# Altium schematic sheet Tree.SchDoc
size B; SheetNumber: 1; SheetTotal: 6
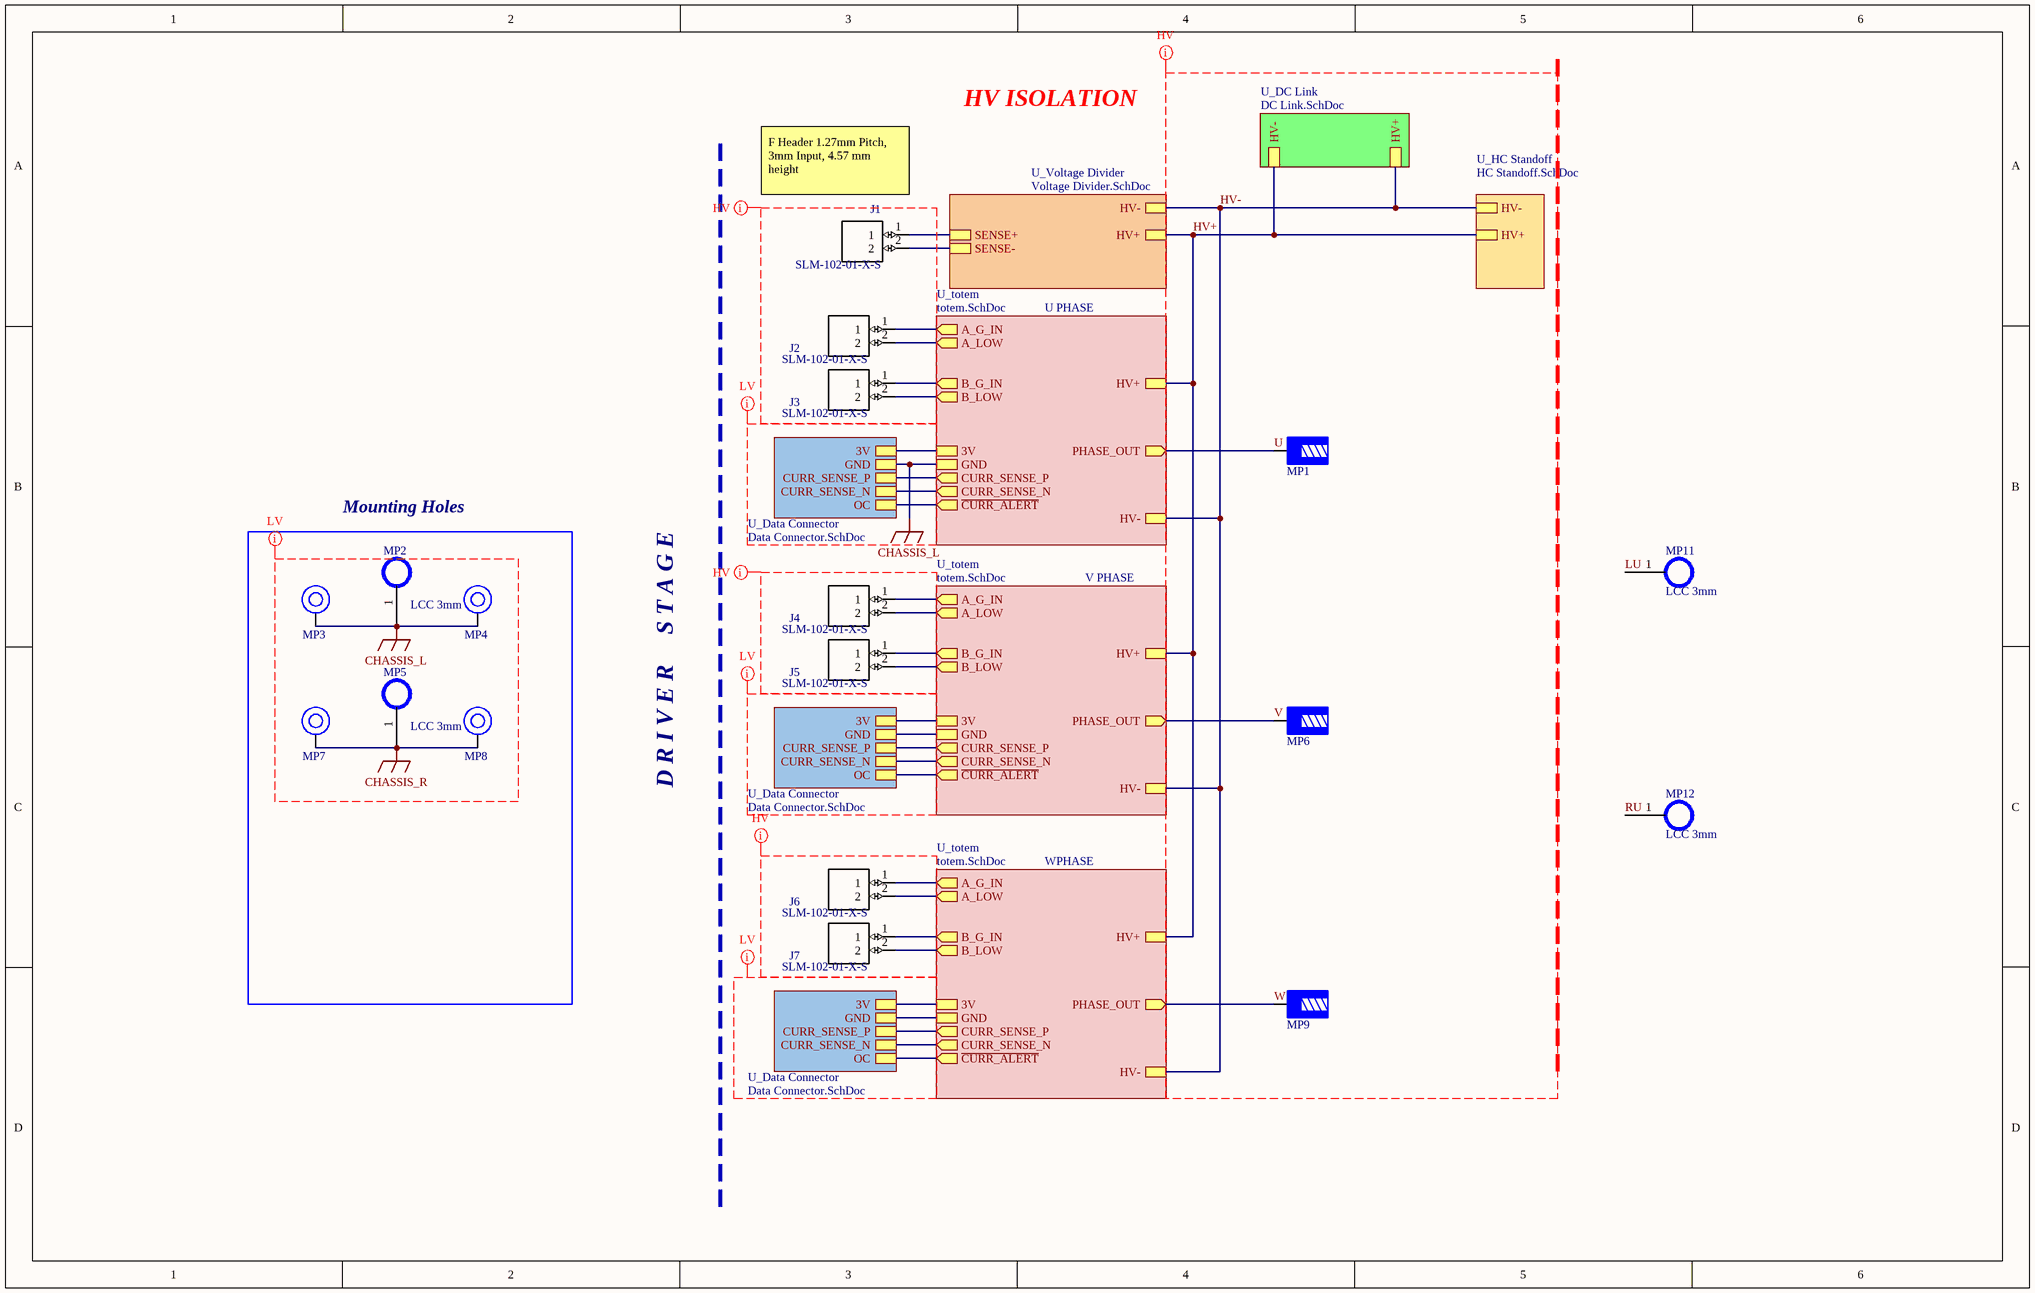
[diagram p0: Tree.SchDoc]

## Parts
J1  SLM-102-01-X-S  [*SLM-102-01-X-S]
J2  SLM-102-01-X-S  [*SLM-102-01-X-S]
J3  SLM-102-01-X-S  [*SLM-102-01-X-S]
J4  SLM-102-01-X-S  [*SLM-102-01-X-S]
J5  SLM-102-01-X-S  [*SLM-102-01-X-S]
J6  SLM-102-01-X-S  [*SLM-102-01-X-S]
J7  SLM-102-01-X-S  [*SLM-102-01-X-S]
MP1  M5 x 6mm  [7460305_HAL]  (value not drawn)
MP2  LCC 3mm  [PAD 3MM]
MP3  hole 3.3mm x 6mm  [9774060960]  (value not drawn)
MP4  hole 3.3mm x 6mm  [9774060960]  (value not drawn)
MP5  LCC 3mm  [PAD 3MM]
MP6  M5 x 6mm  [7460305_HAL]  (value not drawn)
MP7  hole 3.3mm x 6mm  [9774060960]  (value not drawn)
MP8  hole 3.3mm x 6mm  [9774060960]  (value not drawn)
MP9  M5 x 6mm  [7460305_HAL]  (value not drawn)
MP11  LCC 3mm  [PAD 3MM]
MP12  LCC 3mm  [PAD 3MM]

## Blocks framed on the sheet
Mounting Holes: MP2-MP5 MP7 MP8

## Sub-sheets
U_Data Connector = Data Connector.SchDoc: GND, OC, 3V, CURR_SENSE_P, CURR_SENSE_N
U_Data Connector = Data Connector.SchDoc: GND, OC, 3V, CURR_SENSE_P, CURR_SENSE_N
U_Data Connector = Data Connector.SchDoc: GND, OC, 3V, CURR_SENSE_P, CURR_SENSE_N
U_DC Link = DC Link.SchDoc: HV+, HV-
U_HC Standoff = HC Standoff.SchDoc: HV+, HV-
U_totem = totem.SchDoc: PHASE_OUT (out), B_LOW (out), B_G_IN (out), A_LOW (out), A_G_IN (out), ~{CURR_ALERT} (out), HV+, HV-, 3V, GND, CURR_SENSE_P (out), CURR_SENSE_N (out)
U_totem = totem.SchDoc: PHASE_OUT (out), B_LOW (out), B_G_IN (out), A_LOW (out), A_G_IN (out), ~{CURR_ALERT} (out), HV+, HV-, 3V, GND, CURR_SENSE_P (out), CURR_SENSE_N (out)
U_totem = totem.SchDoc: PHASE_OUT (out), B_LOW (out), B_G_IN (out), A_LOW (out), A_G_IN (out), ~{CURR_ALERT} (out), HV+, HV-, 3V, GND, CURR_SENSE_P (out), CURR_SENSE_N (out)
U_Voltage Divider = Voltage Divider.SchDoc: HV+, HV-, SENSE+, SENSE-  | ClassName: U PHASE

## Nets
CHASSIS_L: MP2.1 MP3.1 MP4.1 ; sheet U_Data Connector/GND, sheet U_totem/GND
CHASSIS_R: MP5.1 MP7.1 MP8.1
HV+: sheet U_HC Standoff/HV+, sheet U_Voltage Divider/HV+, sheet U_DC Link/HV-, sheet U_totem/HV+, sheet U_totem/HV+, sheet U_totem/HV+
HV-: sheet U_HC Standoff/HV-, sheet U_Voltage Divider/HV-, sheet U_DC Link/HV+, sheet U_totem/HV-, sheet U_totem/HV-, sheet U_totem/HV-
LU: MP11.1
RU: MP12.1
U: MP1.1 ; sheet U_totem/PHASE_OUT
V: MP6.1 ; sheet U_totem/PHASE_OUT
W: MP9.1 ; sheet U_totem/PHASE_OUT
NetJ1_1: J1.1 ; sheet U_Voltage Divider/SENSE+
NetJ1_2: J1.2 ; sheet U_Voltage Divider/SENSE-
NetJ2_1: J2.1 ; sheet U_totem/A_G_IN
NetJ2_2: J2.2 ; sheet U_totem/A_LOW
NetJ3_1: J3.1 ; sheet U_totem/B_G_IN
NetJ3_2: J3.2 ; sheet U_totem/B_LOW
NetJ4_1: J4.1 ; sheet U_totem/A_G_IN
NetJ4_2: J4.2 ; sheet U_totem/A_LOW
NetJ5_1: J5.1 ; sheet U_totem/B_G_IN
NetJ5_2: J5.2 ; sheet U_totem/B_LOW
NetJ6_1: J6.1 ; sheet U_totem/A_G_IN
NetJ6_2: J6.2 ; sheet U_totem/A_LOW
NetJ7_1: J7.1 ; sheet U_totem/B_G_IN
NetJ7_2: J7.2 ; sheet U_totem/B_LOW
(unnamed): sheet U_Data Connector/OC, sheet U_totem/~{CURR_ALERT}
(unnamed): sheet U_Data Connector/3V, sheet U_totem/3V
(unnamed): sheet U_Data Connector/CURR_SENSE_P, sheet U_totem/CURR_SENSE_P
(unnamed): sheet U_Data Connector/CURR_SENSE_N, sheet U_totem/CURR_SENSE_N
(unnamed): sheet U_Data Connector/GND, sheet U_totem/GND
(unnamed): sheet U_Data Connector/OC, sheet U_totem/~{CURR_ALERT}
(unnamed): sheet U_Data Connector/3V, sheet U_totem/3V
(unnamed): sheet U_Data Connector/CURR_SENSE_P, sheet U_totem/CURR_SENSE_P
(unnamed): sheet U_Data Connector/CURR_SENSE_N, sheet U_totem/CURR_SENSE_N
(unnamed): sheet U_Data Connector/GND, sheet U_totem/GND
(unnamed): sheet U_Data Connector/OC, sheet U_totem/~{CURR_ALERT}
(unnamed): sheet U_Data Connector/3V, sheet U_totem/3V
(unnamed): sheet U_Data Connector/CURR_SENSE_P, sheet U_totem/CURR_SENSE_P
(unnamed): sheet U_Data Connector/CURR_SENSE_N, sheet U_totem/CURR_SENSE_N

## Layout directives
net class HV: (no net found under the mark), HV+, HV-, U, V, W
net class LV: (no net found under the mark), CHASSIS_L, CHASSIS_R

## Notes on the sheet
- HV ISOLATION
- (near J1) F Header 1.27mm Pitch, 3mm Input, 4.57 mm height
- U PHASE
- V PHASE
- D R I V E R     S T A G E
- WPHASE
- MY
- Project
- Author
- Revision
- Sheet
- Modified
- of

## Library data of the parts
MP1 MP6 MP9 = 7460305: WP-BUTR REDCUBE PRESS-FIT with internal thread, two-rows, L9W9H7mm, M5 x 6mm, 160A; Manufacturer: Wurth Elektronik; Surface: Tin; ComponentLink1Description: Website Link; ComponentLink1URL: https://www.we-online.com/redexpert/article/7460305?ad; ComponentLink2Description: Datasheet Link; ComponentLink2URL: https://www.we-online.com/redexpert/spec/7460305?ad; Manufacturer Part Number: 7460305; Category: REDCUBE PRESS-FIT; Match Code: WP-BUTR; Mount: Press Fit; Operating Temperature Max: 150°C; Operating Temperature Min: -55°C; Packaging: Bulk; Length: 9mm; Width: 9mm; Height: 7mm; Material: Brass; Number of Pins: 8; Rated Current: 160A; Thread Length: 6mm; Thread Size: M5
MP3 MP4 MP7 MP8 = 9774060960R: WA-SMST SMT Steel Spacer, OD 6mm, hole 3.3mm x 6mm; Manufacturer: Wurth Elektronik; Surface: Tin; ComponentLink1Description: Website Link; ComponentLink1URL: https://www.we-online.com/redexpert/article/9774060960R?ad; ComponentLink2Description: Datasheet Link; ComponentLink2URL: https://www.we-online.com/redexpert/spec/9774060960R?ad; Manufacturer Part Number: 9774060960R; Category: SMT Spacers; Match Code: WA-SMST; Mount: Surface Mount; Operating Temperature Max: 150°C; Operating Temperature Min: -55°C; Packaging: Tape and Reel; Height: 6mm; Inside Diameter: 3.3mm; Material: Steel; Outside Diameter: 6mm
J1-J7 = SLM-102-01-X-S: Value: *